# EAGLE design CHECon (EAGLE 6.5.0)
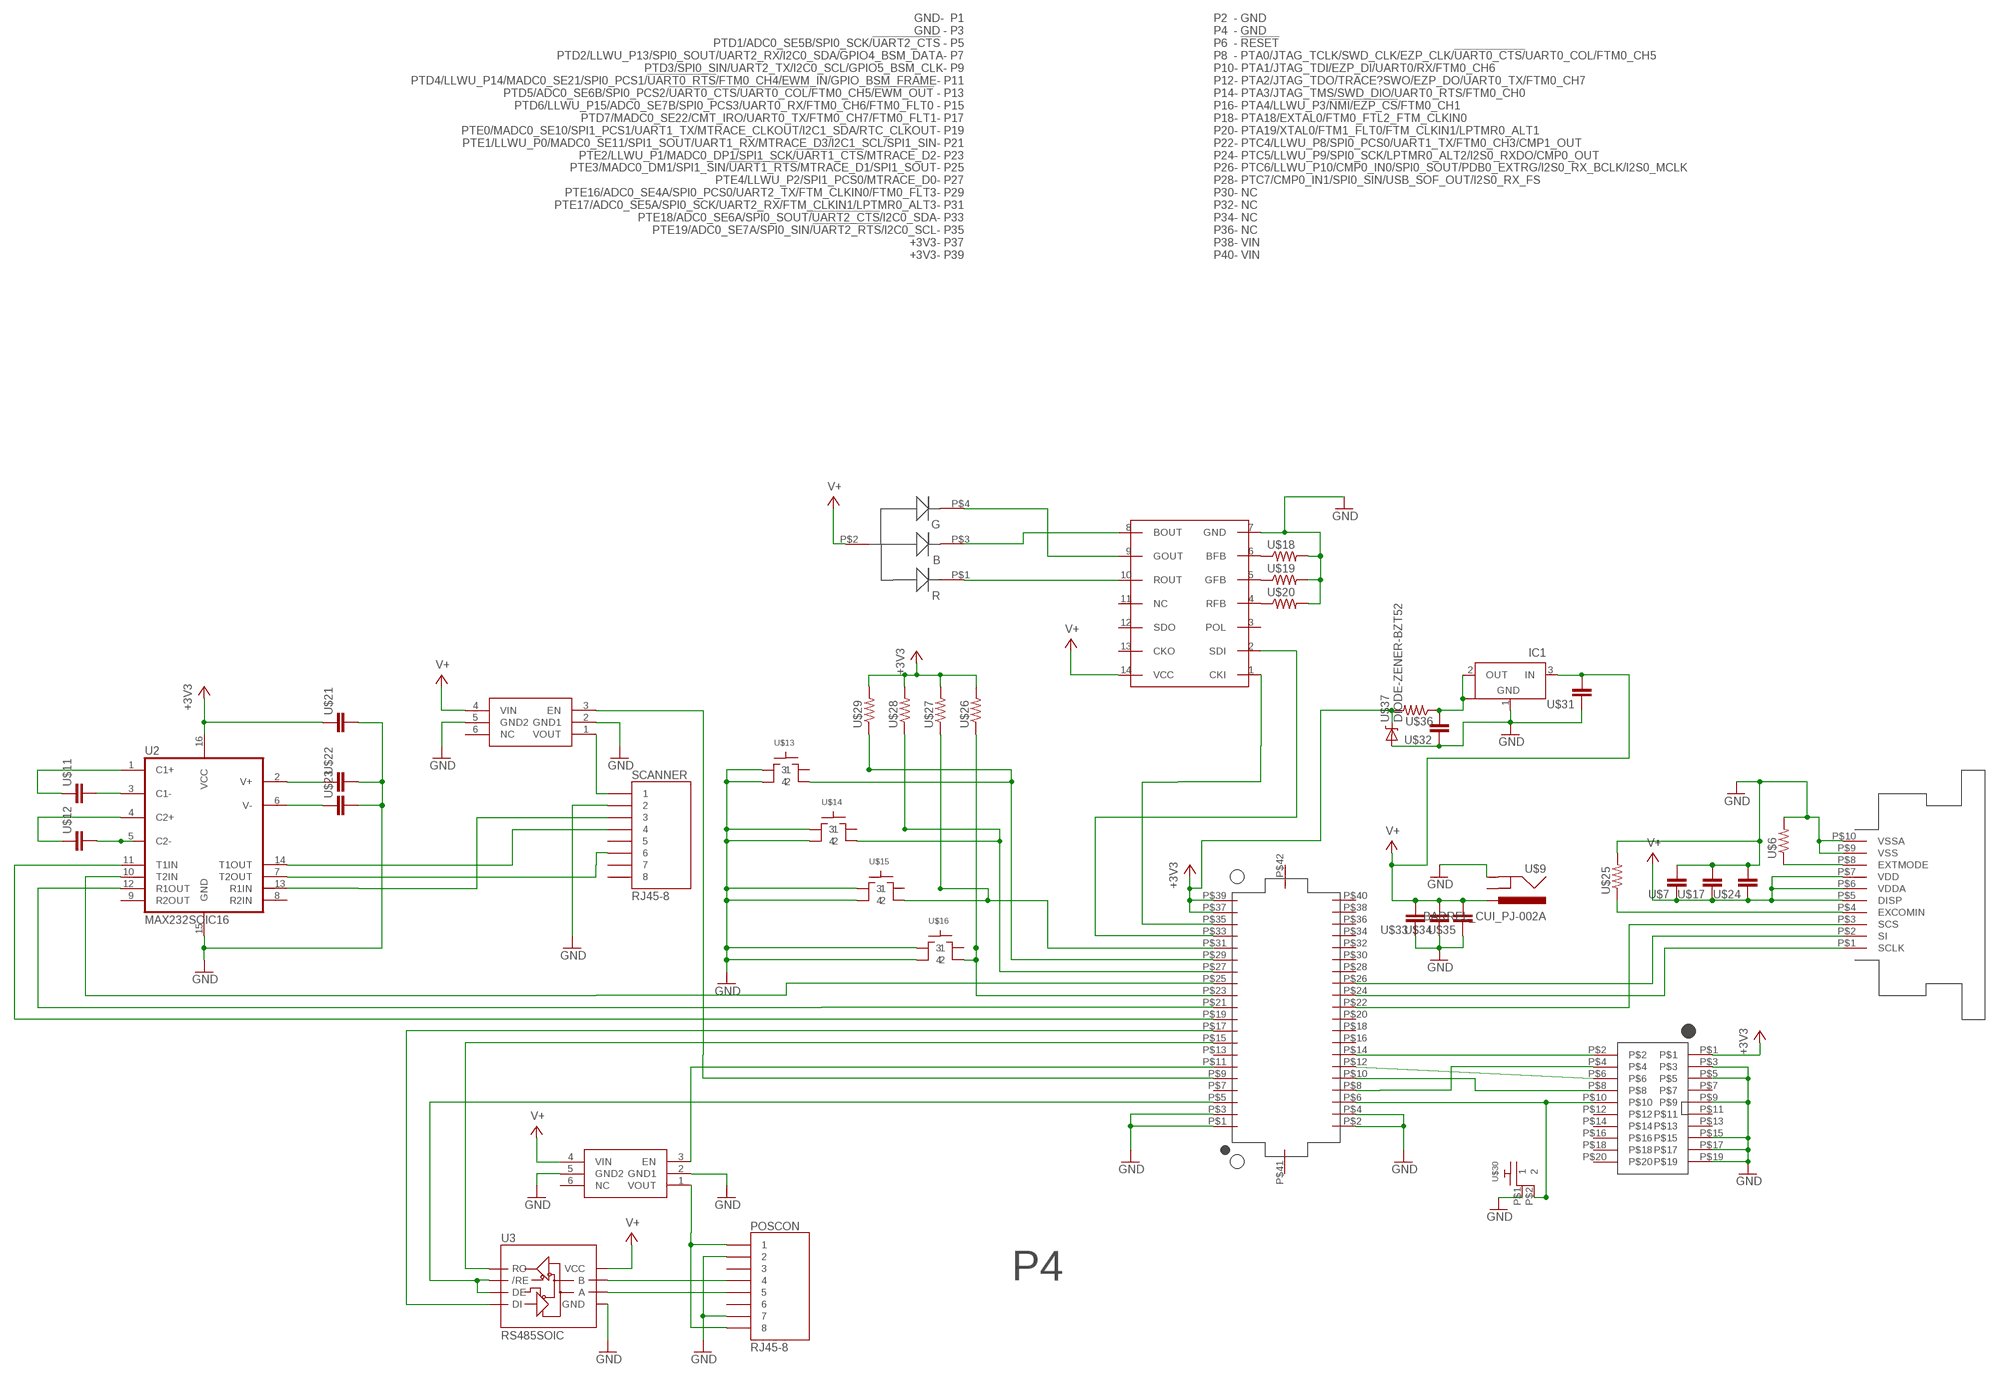
[diagram p0: schematic, sheet 1]

## Parts
IC1  NCP1117ST33T3G_1  [SOT223]
POSCON  RJ45-8  [MOLEX-0955016649]
SCANNER  RJ45-8  [MOLEX-0955016649]
U2  MAX232SOIC16  [SO016]
U3  RS485SOIC  [SO08]
U$1  RGLBED  [RGBLED]
U$2  52745-1097  [52745-1097]
U$3  2X10JTAG  [2X10JTAG]
U$4  MIC94061C6  [SC70-6L]
U$5  MIC94061C6  [SC70-6L]
U$6  RF-R0805  [RF-C0805]
U$7  RF-C0805  [C0805]
U$8  WS2801  [SO14]
U$9  BARREL_CUI_PJ-002A  [BARREL_CUI_PJ-002A]
U$10  DF12_F  [DF12_F]
U$11  RF-C0805  [C0805]
U$12  RF-C0805  [C0805]
U$13  SWITCH-TACTILE  [ESWITCH-TL3301PF]
U$14  SWITCH-TACTILE  [ESWITCH-TL3301PF]
U$15  SWITCH-TACTILE  [ESWITCH-TL3301PF]
U$16  SWITCH-TACTILE  [ESWITCH-TL3301PF]
U$17  RF-C0805  [C0805]
U$18  RF-R0805  [RF-C0805]
U$19  RF-R0805  [RF-C0805]
U$20  RF-R0805  [RF-C0805]
U$21  RF-C0805  [C0805]
U$22  RF-C0805  [C0805]
U$23  RF-C0805  [C0805]
U$24  RF-C0805  [C0805]
U$25  RF-R0805  [RF-C0805]
U$26  RF-R0805  [RF-C0805]
U$27  RF-R0805  [RF-C0805]
U$28  RF-R0805  [RF-C0805]
U$29  RF-R0805  [RF-C0805]
U$30  RA_BUTTON  [RA_BUTTON]
U$31  RF-C0805  [C0805]
U$32  RF-C0805  [C0805]
U$33  RF-C0805  [C0805]
U$34  RF-C0805  [C0805]
U$35  RF-C0805  [C0805]
U$36  RF-R0805  [RF-C0805]
U$37  DIODE-ZENER-BZT52  [SOD-323]

## Nets
+3V3: U2.16(VCC) U$3.P$1 U$10.P$37(+3V3) U$10.P$39(+3V3) U$21.1 U$26.2 U$27.2 U$28.2 U$29.2 U$36.2 U$37.1(C)
C1: U2.1(C1+) U$11.1
C2: U2.4(C2+) U$12.1
GND [GND]: IC1.1(GND) POSCON.P$2 POSCON.P$7 SCANNER.P$2 U2.15(GND) U3.5(GND) U$2.P$9(VSS) U$2.P$10(VSSA) U$3.P$3 U$3.P$5 U$3.P$9 U$3.P$15 U$3.P$17 U$3.P$19 U$4.2(GND1) U$4.5(GND2) U$5.2(GND1) U$5.5(GND2) U$6.2 U$7.2 U$8.7(GND) U$9.P$2(GND) U$10.P$1(GND) U$10.P$2(GND) U$10.P$3(GND) U$10.P$4(GND) U$13.1 U$13.2 U$14.1 U$14.2 U$15.1 U$15.2 U$16.1 U$16.2 U$17.2 U$18.2 U$19.2 U$20.2 U$21.2 U$22.2 U$23.2 U$24.2 U$25.2 U$30.P$1 U$31.1 U$32.1 U$33.1 U$34.1 U$35.1 U$37.2(A)
N$1: U$3.P$2 U$10.P$14(PTA3/JTAG_TMS/SWD_DIO/UART0_RTS/FTM0_CH0)
N$2: U$3.P$6 U$10.P$12(PTA2/JTAG_TDO/TRACE?SWO/EZP_DO/UART0_TX/FTM0_CH7)
N$3: U$3.P$8 U$10.P$10(PTA1/JTAG_TDI/EZP_DI/UART0/RX/FTM0_CH6)
N$4: U$3.P$4 U$10.P$8(PTA0/JTAG_TCLK/SWD_CLK/EZP_CLK/!UART0_CTS/!UART0_COL/FTM0_CH5)
N$5: U$1.P$4(GREEN) U$8.9(GOUT)
N$6: U$3.P$10 U$10.P$6(!RESET) U$30.P$2
N$7: SCANNER.P$6 U2.7(T2OUT)
N$8: U$1.P$3(BLUE) U$8.8(BOUT)
N$9: U$1.P$1(RED) U$8.10(ROUT)
N$10 [GND]: U2.12(R1OUT) U$10.P$21(PTE1/LLWU_P0/MADC0_SE11/SPI1_SOUT/UART1_RX/MTRACE_D3/I2C1_SCL/SPI1_SIN)
N$11: U$8.1(CKI) U$10.P$35(PTE19/ADC0_SE7A/SPI0_SIN/!UART2_RTS!/I2C0_SCL)
N$12 [GND]: SCANNER.P$4 U2.14(T1OUT)
N$13: U$8.6(BFB) U$18.1
N$14: U$8.5(GFB) U$19.1
N$15: U$8.4(RFB) U$20.1
N$16: U$8.2(SDI) U$10.P$33(PTE18/ADC0_SE6A/SPI0_SOUT/!UART2_CTS!/I2C0_SDA)
N$17 [GND]: U3.1(RO) U$10.P$15(PTD6/LLWU_P15/ADC0_SE7B/SPI0_PCS3/UART0_RX/FTM0_CH6/FTM0_FLT0)
N$18: U2.3(C1-) U$11.2
N$19: POSCON.P$4 U3.7(B)
N$20: POSCON.P$5 U3.6(A)
N$21: U2.5(C2-) U$12.2
N$22: U2.6(V-) U$23.1
N$23: U2.2(V+) U$22.1
N$24: POSCON.P$1 POSCON.P$8 U$5.1(VOUT)
N$25 [GND]: SCANNER.P$1 U$4.1(VOUT)
N$26 [GND]: U2.11(T1IN) U$10.P$19(PTE0/MADC0_SE10/SPI1_PCS1/UART1_TX/MTRACE_CLKOUT/I2C1_SDA/RTC_CLKOUT)
N$27 [GND]: U3.4(DI) U$10.P$17(PTD7/MADC0_SE22/CMT_IRO/UART0_TX/FTM0_CH7/FTM0_FLT1)
N$28 [GND]: U3.2(/RE) U3.3(DE) U$10.P$5(PTD1/ADC0_SE5B/SPI0_SCK/!UART2_CTS)
N$29 [GND]: U$2.P$2(SI) U$10.P$26(PTC6/LLWU_P10/CMP0_IN0/SPI0_SOUT/PDB0_EXTRG/I2S0_RX_BCLK/I2S0_MCLK)
N$30 [GND]: U$2.P$1(SCLK) U$10.P$24(PTC5/LLWU_P8/SPI0_PCS0/UART1_TX/FTM0_CH3/CMP1_OUT)
N$31 [GND]: U$2.P$3(SCS) U$10.P$22(PTC4/LLWU_P8/SPI0_PCS0/UART1_TX/FTM0_CH3/CMP1_OUT)
N$32 [GND]: U$2.P$8(EXTMODE) U$6.1
N$33 [GND]: U$2.P$4(EXCOMIN) U$25.1
N$34: U$10.P$23(PTE2/LLWU_P1/MADC0_DP1/SPI1_SCK/!UART1_CTS!/MTRACE_D2) U$16.4 U$26.1
N$35: U$10.P$31(PTE17/ADC0_SE5A/SPI0_SCK/UART2_RX/FTM_CLKIN1/LPTMR0_ALT3) U$15.4 U$27.1
N$36: U$10.P$27(PTE4/LLWU_P2/SPI1_PCS0/MTRACE_D0) U$14.4 U$28.1
N$37: U$10.P$29(PTE16/ADC0_SE4A/SPI0_PCS0/UART2_TX/FTM_CLKIN0/FTM0_FLT3) U$13.4 U$29.1
N$39: U$5.3(EN) U$10.P$11(PTD4/LLWU_P14/MADC0_SE21/SPI0_PCS1/!UART0_RTS!/FTM0_CH4/EWM_IN/GPIO_BSM_FRAME)
N$40: U$4.3(EN) U$10.P$9(PTD3/SPI0_SIN/UART2_TX/I2C0_SCL/GPIO5_BSM_CLK)
N$41: U2.10(T2IN) U$10.P$25(PTE3/MADC0_DM1/SPI1_SIN/!UART1_RTS!/MTRACE_D1/SPI1_SOUT)
OUT1: IC1.2(OUT) IC1.4(OUT1) U$32.2 U$36.1
R1IN: SCANNER.P$3 U2.13(R1IN)
V+: IC1.3(IN) U3.8(VCC) U$1.P$2(ANODE) U$2.P$5(DISP) U$2.P$6(VDDA) U$2.P$7(VDD) U$4.4(VIN) U$5.4(VIN) U$7.1 U$8.14(VCC) U$9.P$1(PWR) U$17.1 U$24.1 U$31.2 U$33.2 U$34.2 U$35.2
Unconnected: POSCON.P$3 POSCON.P$6 SCANNER.P$5 SCANNER.P$7 SCANNER.P$8 U2.8(R2IN) U2.9(R2OUT) U$3.P$7 U$3.P$11 U$3.P$12 U$3.P$13 U$3.P$14 U$3.P$16 U$3.P$18 U$3.P$20 U$4.6(NC) U$5.6(NC) U$8.3(POL) U$8.11(NC) U$8.12(SDO) U$8.13(CKO) U$9.P$3(GNDBREAK) U$10.P$7(PTD2/LLWU_P13/SPI0_SOUT/UART2_RX/I2C0_SDA/GPIO4_BSM_DATA) U$10.P$13(PTD5/ADC0_SE6B/SPI0_PCS2/!UART0_CTS!/!UART0_COL!/FTM0_CH5/!EWM_OUT) U$10.P$16(PTA4/LLWU_P3/!NMI!/!EZP_CS!/FTM0_CH1) U$10.P$18(PTA18/EXTAL0/FTM0_FTL2_FTM_CLKIN0) U$10.P$20(PTA19/XTAL0/FTM1_FLT0/FTM_CLKIN1/LPTMR0_ALT1) U$10.P$28(PTC7/CMP0_IN1/SPI0_SIN/USB_SOF_OUT/I2S0_RX_FS) U$10.P$30(NC) U$10.P$32(NC) U$10.P$34(NC) U$10.P$36(NC) U$10.P$38(VIN) U$10.P$40(VIN) U$10.P$41 U$10.P$42 U$13.3 U$14.3 U$15.3 U$16.3

## Notes on the sheet
- P4

## Library data of the parts
IC1 = KW2:NCP1117ST33T3G_1: VOLTAGE REGULATOR
POSCON SCANNER = GW-devices:RJ45-8: RJ45 Jack MFG part number 54602-908lf; MFGP: 0955016889
U2 = SparkFun:MAX232: RS232 Transceiver Very common IC. This is generically called 'MAX232', but works with the 3V equivalent MAX3232 generic ICs. Field tested and mother approved. Spark Fun Electronics SKU : COM-00316 (DIP) and COM-00589 (SMD); MFGN: TI; MFGP: MAX232DR; PRICE: 0.86
U3 = SparkFun:RS485; MFGN: TI; MFGP: SN65HVD1781DR; PRICE: 4.29
U$1 = KW2:RGLBED; MFGP: CLV1A-FKB-CK1N1G1BB7R4S3
U$2 = KW2:52745-1097; MFGP: 52745-1097
U$3 = KW2:2X10JTAG; MFGP: 3220-20-0100-00
U$4 U$5 = GW-devices:MIC94061; MFGN: Micrel; MFGP: MIC94061YC6 TR; PRICE: 1.50
U$6 U$25-U$29 U$36 = GW-devices:RF-R: RF resistor pads for FSL reference design; MFGP: CRCW080510K0FKEB
U$7 = GW-devices:RF-C: RF capacitor pads for FSL reference design; MFGP: C0805C106M4PACTU
U$8 = GW-devices:WS2801; MFGP: WS2801
U$9 = KW2:BARREL_CUI_PJ-002A; MFGP: PJ-002A
U$10 = KW2:DF12_F; MFGP: DF12(3.0)-40DP-0.5V(86)
U$11 U$12 U$17 U$21-U$23 = GW-devices:RF-C: RF capacitor pads for FSL reference design; MFGP: 0805YD105KAT2A
U$13-U$16 = GW-devices:SWITCH-TACTILE; MFGP: TL3301DF260QG
U$18-U$20 = GW-devices:RF-R: RF resistor pads for FSL reference design; MFGP: CRCW080524R0JNEA
U$24 U$31-U$35 = GW-devices:RF-C: RF capacitor pads for FSL reference design; MFGP: 0805YD104KAT2A
U$30 = KW2:RA_BUTTON; MFGP: 1-1825027-1
U$37 = SparkFun:DIODE-ZENER: Zener Diode Production Part - 8199 3.4V Zener Voltage

## Board
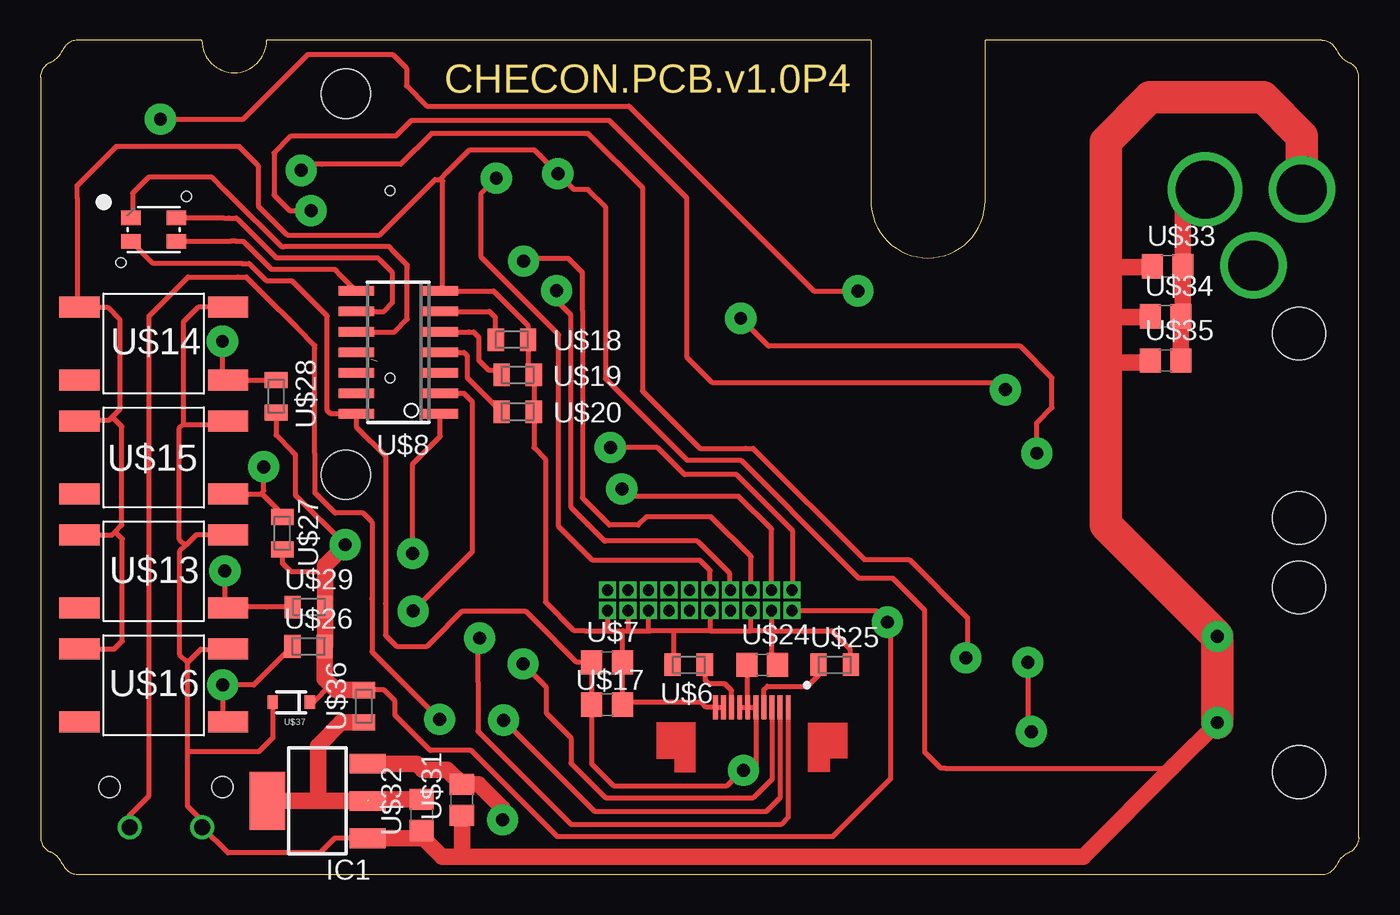
[diagram p1: board, top side]
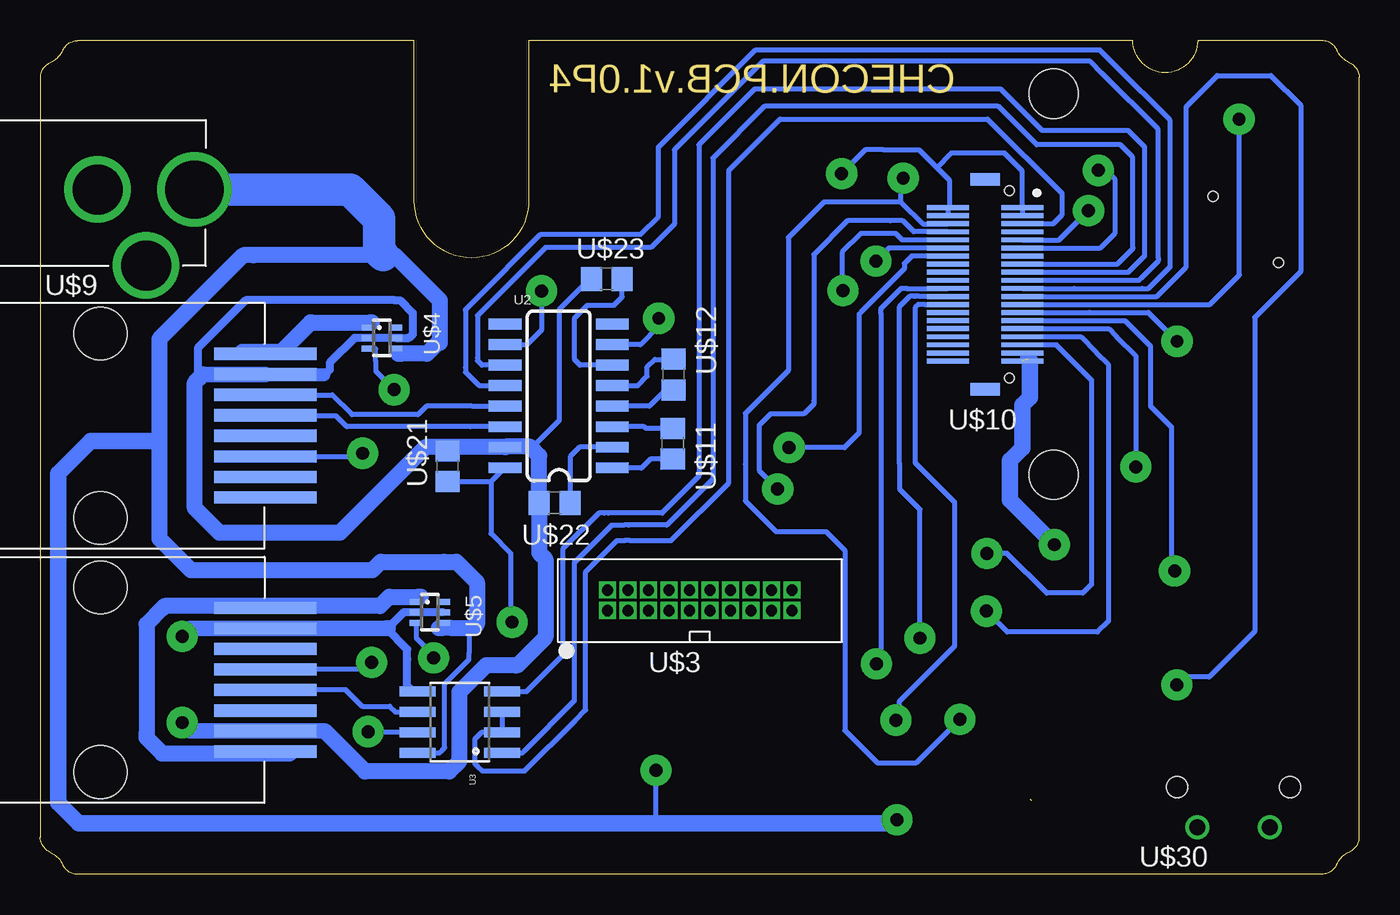
[diagram p2: board, bottom side, seen from below]

Size 81.68 x 51.66 mm. Coordinates in mm from the lower left corner, seen from the top.
Outline: 81.66,2.29 81.66,49.38 arc66 81.07,50.28
Outline: 2.31,0 79.37,0 arc67 80.29,0.61
Outline: 0.02,49.38 0.02,2.29 arc66 0.61,1.38
Outline: 79.37,51.66 58.52,51.66 58.52,41.73 arc-180 51.43,41.73 51.43,51.66 14.02,51.66 arc-180 10,51.66 2.31,51.66 arc67 1.39,51.06
Outline: 79.37,51.66 arc-67 80.29,51.05 arc43 81.07,50.28
Outline: 81.68,2.29 arc-66 81.07,1.37 arc43 80.3,0.6
Outline: 2.31,0.01 arc-67 1.39,0.61 arc43 0.61,1.39
Outline: 0,49.38 arc-66 0.61,50.29 arc43 1.38,51.06
Copper layers (1*16): Top 0.035mm / dielectric 1.5mm / Bottom 0.035mm
Design rules "default *": minimum track width 10mil, minimum drill 0.1mm, track to track 0.4mm, track to pad 0.4mm, pad to pad 0.4mm, via to via 0.4mm, smd to smd 0.4mm, copper to edge 0.1mm, drill to drill 0.1mm, minimum pad ring 0.1mm, minimum via ring 8mil, stop-mask expansion 4mil, vias tented up to drill 0mil, thermal gap 10mil

### Footprints (pad centres in the part's own frame; a part is rotated, then mirrored left to right if it is on the bottom)
SOT223 = smd 1.219 x 2.235: 1 -2.311,-3.099; 2 0,-3.099; 3 2.311,-3.099 | smd 3.6 x 2.2: 4 0,3.099
MOLEX-0955016649 = smd 0.76 x 6.35: P$1 -4.45,10.225; P$2 -3.18,10.225; P$3 -1.91,10.225; P$4 -0.64,10.225; P$5 0.63,10.225; P$6 1.905,10.225; P$7 3.175,10.225; P$8 4.445,10.225 | hole 3.25: -5.715,0; 5.715,0
SO016 = smd 0.66 x 2.032: 1 -4.445,-3.315; 2 -3.175,-3.315; 3 -1.905,-3.315; 4 -0.635,-3.315; 5 0.635,-3.315; 6 1.905,-3.315; 7 3.175,-3.315; 8 4.445,-3.315; 9 4.445,3.315; 10 3.175,3.315; 11 1.905,3.315; 12 0.635,3.315; 13 -0.635,3.315; 14 -1.905,3.315; 15 -3.175,3.315; 16 -4.445,3.315
SO08 = smd 0.61 x 2.21: 1 -1.905,-2.616; 2 -0.635,-2.616; 3 0.635,-2.616; 4 1.905,-2.616; 5 1.905,2.616; 6 0.635,2.616; 7 -0.635,2.616; 8 -1.905,2.616
RGBLED = smd 1.2 x 0.9: P$1 1.4,-0.725; P$2 1.4,0.725; P$3 -1.4,0.725; P$4 -1.4,-0.725 | hole 0.61: 2.019,2.045; -2.019,-2.045
52745-1097 = smd 0.3 x 1.5: P$1 2.25,0.95; P$2 1.75,0.95; P$3 1.25,0.95; P$4 0.75,0.95; P$5 0.25,0.95; P$6 -0.25,0.95; P$7 -0.75,0.95; P$8 -1.25,0.95; P$9 -1.75,0.95; P$10 -2.25,0.95
2X10JTAG = drill 0.7 pad 1 square: P$1 -6.35,-1.27; P$2 -6.35,0; P$3 -5.08,-1.27; P$4 -5.08,0; P$5 -3.81,-1.27; P$6 -3.81,0; P$7 -2.54,-1.27; P$8 -2.54,0; P$9 -1.27,-1.27; P$10 -1.27,0; P$11 0,-1.27; P$12 0,0; P$13 1.27,-1.27; P$14 1.27,0; P$15 2.54,-1.27; P$16 2.54,0; P$17 3.81,-1.27; P$18 3.81,0; P$19 5.08,-1.27; P$20 5.08,0
SC70-6L = smd 0.35 x 0.8: 1 -0.65,-0.85; 2 0,-0.85; 3 0.65,-0.85; 4 0.65,0.85; 5 0,0.85; 6 -0.65,0.85
RF-C0805 = smd 1 x 1.4: 1 -1,0; 2 1,0
C0805 = smd 1.3 x 1.5: 1 -0.95,0; 2 0.95,0
SO14 = smd 0.6 x 2.2: 1 -3.81,-2.6; 2 -2.54,-2.6; 3 -1.27,-2.6; 4 0,-2.6; 5 1.27,-2.6; 6 2.54,-2.6; 7 3.81,-2.6; 8 3.81,2.6; 9 2.54,2.6; 10 1.27,2.6; 11 0,2.6; 12 -1.27,2.6; 13 -2.54,2.6; 14 -3.81,2.6
BARREL_CUI_PJ-002A = drill 3.6: P$1 0,0 | drill 3.1: P$2 6,0; P$3 3,4.7
DF12_F = smd 0.3 x 2.6: P$1 -4.75,2.3; P$2 -4.75,-2.3; P$3 -4.25,2.3; P$4 -4.25,-2.3; P$5 -3.75,2.3; P$6 -3.75,-2.3; P$7 -3.25,2.3; P$8 -3.25,-2.3; P$9 -2.75,2.3; P$10 -2.75,-2.3; P$11 -2.25,2.3; P$12 -2.25,-2.3; P$13 -1.75,2.3; P$14 -1.75,-2.3; P$15 -1.25,2.3; P$16 -1.25,-2.3; P$17 -0.75,2.3; P$18 -0.75,-2.3; P$19 -0.25,2.3; P$20 -0.25,-2.3; P$21 0.25,2.3; P$22 0.25,-2.3; P$23 0.75,2.3; P$24 0.75,-2.3; P$25 1.25,2.3; P$26 1.25,-2.3; P$27 1.75,2.3; P$28 1.75,-2.3; P$29 2.25,2.3; P$30 2.25,-2.3; P$31 2.75,2.3; P$32 2.75,-2.3; P$33 3.25,2.3; P$34 3.25,-2.3; P$35 3.75,2.3; P$36 3.75,-2.3; P$37 4.25,2.3; P$38 4.25,-2.3; P$39 4.75,2.3; P$40 4.75,-2.3 | smd 0.8 x 1.8: P$41 -6.5,0; P$42 6.5,0 | hole 0.6: -5.8,1.5; 5.8,1.5 | hole 3.048: -11.8,4.24; 11.8,4.24
ESWITCH-TL3301PF = smd 2.5 x 1.3: 1 -4.61,2.25; 2 4.61,2.25; 3 -4.61,-2.25; 4 4.61,-2.25
RA_BUTTON = drill 0.99: P$1 -2.25,0; P$2 2.25,0 | hole 1.3: -3.501,2.49; 3.501,2.49
SOD-323 = smd 0.63 x 0.83: 1 -1.15,0; 2 1.15,0

### Placement (x,y rotation side)
IC1  17.17,4.55 90 top
POSCON  77.96,12.05 270 bottom
SCANNER  77.96,27.79 270 bottom
U2  49.58,29.64 90 bottom
U3  55.7,9.42 90 bottom
U$1  7.02,39.94 180 top
U$2  44.07,9.4 0 top
U$3  40.2,17.61 0 bottom
U$4  60.52,33.22 270 bottom
U$5  57.55,16.23 270 bottom
U$6  40.15,12.98 180 top
U$7  35.1,13.13 0 top
U$8  22.17,32.33 90 top
U$9  72.13,42.42 180 bottom
U$10  23.16,36.55 270 bottom
U$11  42.52,26.67 90 bottom
U$12  42.46,30.96 90 bottom
U$13  7.02,18.77 0 top
U$14  7.02,32.88 0 top
U$15  7.02,25.82 0 top
U$16  7.02,11.71 0 top
U$17  35.1,10.52 0 top
U$18  29.21,33.12 0 top
U$19  29.56,30.94 0 top
U$20  29.56,28.65 0 top
U$21  56.46,25.27 90 bottom
U$22  49.83,23.01 180 bottom
U$23  46.61,36.88 180 bottom
U$24  44.7,12.98 0 top
U$25  49.2,12.98 0 top
U$26  16.61,14.12 0 top
U$27  14.98,21.13 270 top
U$28  14.6,29.62 270 top
U$29  16.63,16.56 0 top
U$30  7.77,2.92 0 bottom
U$31  26.11,4.62 90 top
U$32  23.62,3.68 90 top
U$33  69.82,37.67 0 top
U$34  69.69,34.57 0 top
U$35  69.69,31.83 0 top
U$36  20.04,10.41 90 top
U$37  15.54,10.67 180 top

### Tracks (layer width: path | path; a pad name or v marks a point on that pad's centre or on a via)
+3V3  (via drill 0.8 pad 1.93)  (1 unrouted)
  Top 0.305: U$3.P$1 49.7,16.34 51.76,16.34 v52.47,15.62 52.68,15.42 52.68,5.94 49.07,2.34 32.03,2.34 26.69,7.67 24.15,7.67 23.39,8.43 21.97,9.85 21.97,10.74 21.3,11.41 U$36.2 | U$27.2 14.98,19.28 15.49,18.77 17.63,18.77 | U$28.2 14.6,27.2 15.57,26.24 15.8,26.01 15.8,23.49 v18.87,20.42 | U$37.1 16.91,10.67 17.98,11.73
  Top 1.016: v18.87,20.42 18.87,20.38 17.63,19.14 17.63,18.77 U$29.2 17.63,14.15 U$26.2 17.61,12.1 17.98,11.73 18.29,11.41 U$36.2
  Bottom 0.305: 21.61,25.65 21.64,25.63 | U$10.P$37 U$10.P$39 | U$21.1 53.77,24.32 | 53.77,24.32 U2.16 | 53.77,24.32 53.77,21.1 52.55,19.89 52.55,15.7 v52.47,15.62
  Bottom 1.016: 21.61,25.65 20.86,26.4 20.86,29.07 20.39,29.54 20.39,31.83 20.49,31.93 | v18.87,20.42 20.52,22.07 21.64,23.19 21.64,25.63
C1
  Bottom 0.305: U$11.1 43.9,25.72 44.45,25.17 46.24,25.17 U2.1
C2
  Bottom 0.305: U$12.1 42.96,30.01 43.96,29.01 U2.4
GND  (via drill 0.8 pad 1.93)
  Top 0.305: U$3.P$9 41.47,15.09 | 41.47,15.09 39.21,15.09 | 39.21,15.09 37.79,15.09 | 37.79,15.09 37.66,15.09 U$3.P$15 | U$3.P$17 36.39,15.09 36.45,15.09 | 36.45,15.09 37.79,15.09 | U$3.P$19 35.12,15.09 35.25,15.09 | 35.25,15.09 36.06,15.09 | 36.06,15.09 36.45,15.09 | 41.47,15.09 44.01,15.09 | 44.01,15.09 U$3.P$5 | 35.25,15.09 33.7,15.09 33.07,15.09 31.29,16.87 31.29,25.7 30.56,26.43 U$20.2 U$19.2 30.21,31.29 U$18.2 30.2,33.13 30.2,34.01 29.59,34.62 28.06,36.14 24.91,36.14 | U$16.2 11.72,14.05 11.73,14.05 11.3,14.05 11.17,13.92 11.15,13.94 9.93,13.94 9.11,13.13 | U$15.2 11.63,27.89 11.58,27.84 8.99,27.84 | 45.67,13.03 45.65,13.01 U$24.2 45.28,13.34 45.28,15.09 | U$8.7 24.91,36.14 | 24.91,36.14 24.91,42.95 24.82,43.04 | 24.82,43.04 24.79,43.08 25.23,43.52 26.59,44.88 30.6,44.88 30.6,44.86 31.96,43.5 32.15,43.31 | U$2.P$9 U$2.P$10 41.24,10.35 40.94,10.64 36.18,10.64 U$17.2 U$7.2 36.05,15.07 36.06,15.09 | U$3.P$3 45.28,15.09 | 45.28,15.09 44.01,15.09 | 45.28,15.09 49.02,15.09 50.14,13.97 50.14,13.04 U$25.2 | 39.21,15.09 39.21,13.04 U$6.2 | 32.15,43.31 33.04,42.42 33.93,42.42 35,41.35 35,30.71 38.38,27.33 40.05,25.65 43.38,25.65 49.63,19.41 50.69,18.34 52.8,18.34 54.78,16.36 54.78,7.57 55.77,6.58 56.05,6.58 70.05,6.58 70.07,6.58 70.15,6.65 | 32.15,43.31 v32.05,43.41 | IC1.1 18.23,2.23 17.32,1.32 11.62,1.32 U$30.P$1 10.02,3.31 9.11,4.22 9.11,7.65 | 4.45,28.33 4.92,28.8 4.92,34.37 4.16,35.13 U$14.1 2.28,35.26 2.28,41.91 2.28,42.67 4.7,45.08 12.32,45.08 13.46,43.94 13.51,43.89 13.51,41.38 14.02,40.87 15.29,39.6 21,39.6 24.44,43.04 24.82,43.04 | 4.45,28.33 4.24,28.12 2.46,28.12 U$15.1
  Top 0.305: U$13.1 4.43,21.02 4.63,21.22 | 4.63,21.22 5.05,21.64 5.05,27.74 4.45,28.33 | U$16.1 4.58,13.96 5.08,14.45 5.08,20.78 4.63,21.22 | 9.11,7.65 9.11,13.13 | U$13.2 9.64,21.02 8.99,20.37 | 8.99,20.37 8.61,19.99 8.61,13.64 9.11,13.13 | 8.99,27.84 8.81,27.84 8.58,27.61 8.58,20.78 8.99,20.37 | U$14.2 9.78,35.13 8.86,34.21 8.86,27.97 8.99,27.84 | U$33.1 68.82,37.62 | U$34.1 68.69,34.52 | U$35.1 68.62,31.7 | 9.11,7.65 9.17,7.59 13.53,7.59 14.39,8.45 U$37.2
  Top 1.016: 70.15,6.65 70.28,6.78 | 70.28,6.78 v72.89,9.4 | 70.28,6.78 64.59,1.09 26.01,1.09 | 26.01,1.09 24.89,1.09 23.75,2.23 23.62,2.23 | 23.62,2.23 IC1.1 | U$32.1 23.62,2.23 | U$31.1 26.11,1.19 26.01,1.09 | 68.82,37.62 65.99,37.62 | 68.69,34.52 65.99,34.52 | 68.62,31.7 65.99,31.7
  Top 2: U$9.P$2 78.13,45.74 75.74,48.13 68.73,48.13 65.99,45.39 65.99,40.87 65.99,37.62 65.99,34.52 65.99,31.7 65.99,22.43 65.99,21.64 v72.89,14.73 v72.89,9.4
  Bottom 0.305: U$10.P$3 U$10.P$1 20.86,43.06 20.86,43.55 20.86,43.57 21.97,44.68 25.27,44.68 26.16,43.79 | U$10.P$2 25.47,41.31 U$10.P$2 | U$5.5 56.77,16.23 | POSCON.P$2 | 51.32,26.45 51.36,26.49 | 52.87,26.49 U2.15 | 56.22,26.47 U$21.2 | 26.16,43.79 27.25,44.88 29.46,44.88 30.58,44.88 v32.05,43.41 | 26.16,43.79 25.38,43.01 25.38,41.38 U$10.P$2 | U$23.2 47.67,36.88 49.55,35 49.55,28.12 51.27,26.4 | U$10.P$2 U$10.P$4
  Bottom 0.406: 67.7,30.94 SCANNER.P$2
  Bottom 0.5: 56.77,16.23 U$5.2 59.18,16.23 60.17,15.24 | 60.25,15.24 58.95,13.94 58.95,13.33 58.95,11.68 58.59,11.33 U3.5 | U$4.5 59.31,33.22 | 59.31,33.22 U$4.2 61.82,33.22 62.23,33.22 63.75,31.7 63.75,31.27 64.11,30.91 64.16,30.91 64.13,30.94 64.11,30.94 | 59.31,33.22 58.95,33.22 58.85,33.22 58.62,33.45 58.62,34.77 59.41,35.56 59.74,35.56 68.96,35.56 71.93,32.59 71.93,30.84 71.83,30.73
  Bottom 0.813: 64.11,30.94 64.13,30.94 67.7,30.94 | 72.39,15.23 v72.89,14.73
  Bottom 0.95: 60.25,15.24 POSCON.P$2 | POSCON.P$2 72.39,15.23 | 71.6,30.96 67.74,30.96 SCANNER.P$2 | v72.89,9.4 72.79,9.3 72.37,8.88 POSCON.P$7 64.09,8.88 64.07,8.88 64.01,8.82
  Bottom 1: 60.17,15.24 60.25,15.24 | 51.32,26.45 51.27,26.4 50.78,25.92 U$22.2 50.78,19.92 50.39,19.53 50.39,14.68 50.96,14.11 | 51.36,26.49 52.87,26.49 | U2.15 56.22,26.47 57.83,26.47 60.83,23.47 63.14,21.16 70.58,21.16 72.11,22.68 72.11,30.45 71.83,30.73 71.6,30.96 | 64.01,8.82 61.57,6.38 56.36,6.38 55.72,7.01 55.72,8.1 55.72,11.3 54.07,12.95 52.32,12.95 52.12,12.95 50.96,14.11 | 50.96,14.11 50.69,14.38
N$1  (via drill 0.8 pad 1.93)
  Top 0.305: U$3.P$2 46.58,17.63 46.58,21.31 43.13,24.76 39.9,24.76 38.22,26.44 v35.3,26.44
  Bottom 0.305: U$10.P$14 27.61,38.3 27.71,38.3 28.16,37.85 28.16,37.52 30.88,34.8 30.96,34.72 30.96,34.42 30.96,27.36 31.87,26.44 v35.3,26.44
N$2  (via drill 0.8 pad 1.93)
  Top 0.305: U$3.P$6 44.01,19.68 41.55,22.15 37.54,22.15 37.03,21.64 35.25,21.64 33.58,23.32 33.58,34.95 33.58,37.29 32.71,38.15 29.94,38.15 29.94,38.02 v29.92,38
  Bottom 0.305: 25.47,38.81 U$10.P$12 28.99,38.8 29.12,38.8 v29.92,38
N$3  (via drill 0.8 pad 1.93)
  Top 0.305: U$3.P$8 42.67,17.68 42.67,18.67 40.69,20.65 35,20.65 34.95,20.65 32.84,22.76 32.84,34.67 31.97,35.53 v31.97,36.17
  Bottom 0.305: U$10.P$10 28.3,39.3 28.7,39.7 30.86,39.7 32.03,38.53 32.03,36.7 | 32.03,36.7 32.03,36.42 | v31.97,36.17 31.97,36.22 31.97,36.25 32.03,36.3 32.03,36.7
N$4  (via drill 0.8 pad 1.93)
  Top 0.305: U$3.P$4 45.28,21.39 43.25,23.42 37.54,23.42 36.47,23.42 v36.01,23.88
  Bottom 0.305: U$10.P$8 27.58,39.8 28.27,40.49 29.05,40.49 31.7,40.49 33.78,38.4 33.78,29.34 33.78,29.13 34.39,28.52 35.81,28.52 36.45,28.52 37.16,27.81 37.16,25.02 v36.01,23.88
N$5
  Top 0.305: U$8.9 21.28,34.87 21.81,35.41 21.81,37.26 21.13,37.95 21.03,38.05 20.9,38.18 15.29,38.18 14.63,38.18 12.24,40.56 12.14,40.67 11.68,40.67 11.35,40.67 8.63,40.67 8.56,40.59 8.5,40.59 U$1.P$4
N$6  (via drill 0.8 pad 1.93)
  Top 0.305: U$3.P$10 41.47,18.82 40.84,19.46 34.41,19.46 34.21,19.46 32.1,21.56 32.1,33.43 31.54,33.98 27.3,38.23 27.3,38.25 27.3,42.19 v28.24,43.13 | U$30.P$2 5.52,3.67 6.73,4.88 6.73,34.59 9.14,37.01 12.24,37.01 12.75,37.01 13.81,35.94 15.92,33.83 16.99,32.77 16.99,32.59 16.99,26.06 16.99,23.65 18.26,22.38 19.99,22.38 20.54,21.82 20.54,17.12 20.54,17.04 20.54,13.79 v24.74,9.6 24.23,10.11
  Bottom 0.305: 28.37,41.66 27,40.28 25.48,40.28 U$10.P$6 | 28.37,41.66 28.37,43 v28.24,43.13 | 28.37,41.66 29.33,41.66 33.14,41.66 33.74,41.06 | 33.7,41.1 33.74,41.06 | 33.74,41.06 35.35,39.45 35.35,31.22 38.02,28.55 38.02,25.4 38.02,23.14 36.12,21.23 33.27,21.23 33.02,21.23 31.85,20.07 31.85,8.92 29.84,6.91 27.43,6.91 v24.74,9.6
N$7  (via drill 0.8 pad 1.93)
  Top 0.305: v61.72,26.09 61.72,27.97 62.66,28.9 62.66,30.76 60.7,32.71 45.11,32.71 v43.38,34.44
  Bottom 0.305: v43.38,34.44 43.38,33.96 44.52,32.82 U2.7 | SCANNER.P$6 61.92,25.89 v61.72,26.09
N$8
  Top 0.305: U$1.P$3 11.78,39.21 12.11,39.21 12.57,39.21 12.75,39.04 14.32,37.46 14.86,37.46 18.25,37.46 18.38,37.34 18.58,37.13 U$8.8
N$9
  Top 0.305: U$8.10 21.94,33.6 22.73,34.39 22.73,37.57 22.73,37.74 21.79,38.68 21.71,38.76 21.59,38.89 15.13,38.89 14.93,38.89 11.73,42.09 11.45,42.37 10.64,43.18 6.7,43.18 5.71,42.19 5.71,40.75 U$1.P$1
N$10
  Bottom 0.305: U$10.P$21 17.65,36.3 13.46,36.3 13.05,36.3 11.71,37.64 11.71,38.05 11.71,46.71 15.15,50.15 | 15.08,50.09 15.15,50.15 | 15.15,50.15 16.07,51.08 37.39,51.08 43.4,45.06 43.4,40.74 44.5,39.65 50.69,39.65 54.82,35.52 | U2.12 54.45,30.28 54.5,30.28 55.19,30.96 55.29,31.06 55.34,31.11 55.34,31.42 55.34,34.95 55.34,35 55.19,35.15 54.91,35.43 | 54.82,35.52 54.91,35.43 | 54.91,35.43 54.82,35.52
N$11  (via drill 0.8 pad 1.93)
  Top 0.305: 24.79,28.51 U$8.1 24.76,27.13 23.06,25.43 v23.06,19.89
  Bottom 0.305: U$10.P$35 18.74,32.79 17.17,31.22 16.58,30.63 16.58,18.03 16.58,17.96 17.12,17.42 19.35,17.42 21.81,19.89 v23.06,19.89
N$12
  Bottom 0.305: U2.14 55.04,27.74 62.71,27.74 63.37,28.4 67.59,28.4 67.61,28.37
  Bottom 0.406: 67.59,28.4 67.61,28.37 67.67,28.37 SCANNER.P$4
N$13
  Top 0.305: U$8.6 27.81,34.87 28.16,34.52 28.16,33.16 U$18.1
N$14
  Top 0.305: U$8.5 26.54,33.6 26.82,33.6 27.15,33.27 27.15,31.85 27.76,31.24 28.26,31.24 U$19.1
N$15
  Top 0.305: U$8.4 25.65,32.33 26.23,32.33 26.44,32.13 26.44,30.78 U$20.1
N$16  (via drill 0.8 pad 1.93)
  Top 0.305: 24.75,29.77 U$8.2 26.23,29.79 26.77,29.26 26.77,28.83 26.77,19.99 v23.08,16.31
  Bottom 0.305: U$10.P$33 17.24,33.3 16.28,32.33 15.54,31.6 15.54,15.65 15.57,15.65 16.2,15.01 21.79,15.01 v23.08,16.31
N$17
  Bottom 0.305: U$10.P$15 15.84,37.8 14.98,37.8 14.02,38.76 14.02,38.86 14.02,44.42 14.78,45.19 19.96,45.19 22.35,47.57 36.83,47.57 40.03,44.37 40.03,24.49 42.87,21.64 45.23,21.64 45.54,21.64 46.28,21.64 48.54,19.38 48.59,19.33 48.61,19.3 48.61,18.19 48.61,10.74 51.74,7.62 51.84,7.52 U3.1
N$18
  Bottom 0.305: U$11.2 44.18,27.62 44.29,27.74 U2.3
N$19  (via drill 0.8 pad 1.93)
  Top 0.305: v61.16,13.13 61.16,9.07 v61.39,8.84
  Bottom 0.305: 67.72,12.67 POSCON.P$4 67.7,12.73 61.57,12.73 v61.16,13.13 | v61.39,8.84 61.3,8.93 61.16,8.79 U3.7
N$20
  Bottom 0.305: POSCON.P$5 67.67,11.35 67.61,11.35 67.53,11.43 62.81,11.43 62.76,11.43 61.74,10.41 60.04,10.41 59.69,10.06 U3.6
N$21
  Bottom 0.305: U2.5 44.67,30.28 44.09,30.86 44.09,31.44 43.63,31.9 U$12.2
N$22
  Bottom 0.305: U2.6 48.26,31.55 48.59,31.88 48.59,34.47 47.8,35.25 46.15,35.25 45.64,35.76 45.64,36.87 U$23.1
N$23
  Bottom 0.305: U2.2 48.28,26.47 48.87,25.88 48.87,23.03 U$22.1
N$24
  Bottom 0.305: 67.74,16.51 POSCON.P$1 67.73,16.61 67.74,16.62 | U$5.1 58.4,17.06 58.26,17.2 | 66.24,7.49 67.62,7.49 POSCON.P$8
  Bottom 1: 58.11,17.2 58.26,17.2 60.07,17.2 60.65,16.62 67.66,16.62 67.74,16.62 73.98,16.62 74.1,16.5 75.1,15.49 75.1,8.71 75.1,8.46 74.14,7.49 66.24,7.49
N$25
  Bottom 0.305: U$4.1 61.37,34.05 61.24,34.19 | SCANNER.P$1 67.74,32.36
  Bottom 1: 61.16,34.19 61.24,34.19 64.89,34.19 64.94,34.19 65.96,33.17 66.77,32.36 67.74,32.36 69.17,32.36
N$26
  Bottom 0.305: U$10.P$19 18.11,36.8 13.84,36.8 13.64,36.8 13.53,36.91 12.44,38 12.44,38.2 12.44,46.15 15.9,49.61 16.66,50.37 36.93,50.37 42.41,44.88 42.41,40.28 43.86,38.84 50.19,38.84 50.39,38.84 54.43,34.8 54.61,34.62 54.61,32 54.61,31.83 54.33,31.55 U2.11
N$27
  Bottom 0.305: U$10.P$17 15.17,37.3 14.31,37.3 13.28,38.33 13.28,44.78 13.28,45.06 14.3,46.08 19.63,46.08 21.81,48.26 22.2,48.64 37.44,48.64 37.82,48.26 38.06,48.02 40.89,45.19 40.89,24.66 41.8,23.75 43.18,22.38 46.5,22.38 46.76,22.38 47.09,22.38 49.32,20.14 49.32,18.67 49.32,13.56 51.56,11.33 U3.4
N$28
  Bottom 0.305: U3.3 U3.2 54.35,8.79 54.56,8.58 54.76,8.38 54.76,6.86 54.56,6.65 54.3,6.4 53.84,6.4 51.69,6.4 48.54,9.55 47.9,10.19 47.9,18.74 45.97,20.68 45.49,20.68 45.16,20.68 42.62,20.68 39.04,24.26 39.04,43.61 35.86,46.79 23.01,46.79 18.39,42.16 18.39,40.87 18.94,40.31 U$10.P$5
N$29  (via drill 0.8 pad 1.93)
  Top 0.305: U$2.P$2 45.82,4.75 44.95,3.89 34.36,3.89 29.1,9.14 v28.7,9.55
  Bottom 0.305: U$10.P$26 26.92,35.31 27.1,35.31 27.12,35.31 27.3,35.31 27.5,35.1 27.5,34.92 27.5,25.5 25.07,23.06 25.07,14.12 28.5,10.69 28.5,9.75 v28.7,9.55
N$30  (via drill 0.8 pad 1.93)
  Top 0.305: U$2.P$1 46.32,3.75 | 46.32,3.75 46.32,3.7 | 46.32,3.75 46.32,3.52 45.87,3.07 32.89,3.07 27.1,8.86 27.1,11.94 27.1,14.53 v27.2,14.63
  Bottom 0.305: U$10.P$24 25.47,35.81 25.62,35.81 27.25,35.81 27.45,35.81 27.58,35.81 27.81,35.81 28.5,35.13 28.5,25.48 28.44,25.43 28.44,23.85 27.2,22.61 v27.2,14.63
N$31  (via drill 0.8 pad 1.93)
  Top 0.305: U$2.P$3 45.32,6.46 45.32,5.9 44.17,4.75 35,4.75 32.86,6.88 32.86,8.46 31.34,9.98 31.34,11.58 v29.89,13.03
  Bottom 0.305: U$10.P$22 | U$10.P$22 25.6,36.3 28.04,36.3 28.32,36.3 28.37,36.3 29.54,35.13 29.61,35.05 29.61,35 29.61,34.72 29.61,24.41 29.61,13.31 v29.89,13.03
N$32
  Top 0.305: U$2.P$8 42.82,11.38 42.41,11.79 41.42,11.79 41.2,12.01 41.2,12.94 U$6.1
N$33
  Top 0.305: U$2.P$4 44.82,11.44 45.03,11.66 47.52,11.66 48.18,12.32 48.18,12.96 U$25.1
N$34  (via drill 0.8 pad 1.93)
  Top 0.305: U$16.4 11.69,9.46 11.78,9.55 11.83,9.55 12.01,9.37 11.78,9.37 | 11.78,9.37 11.72,9.37 U$16.4 | 11.88,9.47 11.78,9.37 | U$16.4 11.3,9.79 v11.3,11.73 13.22,11.73 U$26.1
  Bottom 0.305: v11.3,11.73 10.82,12.22 9.29,12.22 6.47,15.04 6.47,34.49 3.63,37.34 3.63,47.65 5.46,49.48 8.78,49.48 10.72,47.55 10.72,37.62 12.53,35.8 U$10.P$23
N$35  (via drill 0.8 pad 1.93)
  Top 0.305: v13.84,25.25 13.84,23.75 13.7,23.61 | U$15.4 13.66,23.57 13.7,23.61 | U$27.1 14.98,22.33 13.7,23.61
  Bottom 0.305: U$10.P$31 15.51,33.8 15.03,33.32 13.84,32.13 v13.84,25.25
N$36  (via drill 0.8 pad 1.93)
  Top 0.305: v11.27,33.02 11.27,30.99 U$14.4 14.59,30.63 U$28.1
  Bottom 0.305: U$10.P$27 16.69,34.8 13.05,34.8 v11.27,33.02
N$37  (via drill 0.8 pad 1.93)
  Top 0.305: U$29.1 14.02,16.56 11.67,16.56 U$13.4 11.43,16.73 v11.43,18.8
  Bottom 0.305: U$10.P$29 18.47,34.3 14.54,34.3 14.51,34.3 12.92,32.71 12.92,29.01 11.63,27.71 11.63,19.18 11.43,18.97 v11.43,18.8
N$39  (via drill 0.8 pad 1.93)
  Top 0.305: v57.32,13.41 57.43,13.51 57.43,15.9 53.82,19.51 51.02,19.51 44.14,26.39 43.68,26.39 40.84,26.39 37.28,29.95 37.28,42.54 33.93,45.9 24.23,45.9 22.32,43.99 17.45,43.99 16.53,43.99 v16.15,43.61
  Bottom 0.305: U$5.3 58.4,15.07 58.4,14.67 58.4,14.64 57.29,13.53 57.29,13.45 v57.32,13.41 | v16.15,43.61 15.67,43.61 15.13,43.08 15.13,39.7 16,38.84 16.03,38.8 U$10.P$11
N$40  (via drill 0.8 pad 1.93)
  Top 0.305: v59.76,30.02 59.31,30.48 41.6,30.48 40.03,32.05 40.03,41.91 35.23,46.71 22.98,46.71 22.02,45.75 15.54,45.75 14.47,44.68 14.47,42.09 15.44,41.12 v16.76,41.12
  Bottom 0.305: v59.76,30.02 60.91,31.17 60.91,31.78 60.91,32.56 60.92,32.57 U$4.3 | U$10.P$9 18.58,39.3 v16.76,41.12
N$41  (via drill 0.8 pad 1.93)
  Top 0.305: v7.44,46.79 12.57,46.79 16.58,50.8 21.81,50.8 22.68,49.94 22.68,48.84 23.92,47.6 36.45,47.6 42.11,41.94 47.9,36.14 v50.64,36.14
  Bottom 0.305: U$10.P$25 9.25,35.3 7.41,37.13 7.41,46.76 v7.44,46.79 | v50.64,36.14 50.64,33.71 51.56,32.79 52.87,32.79 U2.10
OUT1  (1 unrouted)
  Top 1.016: U$32.2 20.35,4.63 | IC1.2 17.24,4.55 | 17.24,4.55 IC1.4 | U$36.1 18.63,9.41 17.19,7.98 17.19,4.6 17.24,4.55
R1IN
  Bottom 0.305: U2.13 54.78,29.01 54.94,29.01 57.76,29.01 58.14,28.63 58.29,28.47 62.38,28.47 63.6,29.69 SCANNER.P$3
V+  (via drill 0.8 pad 1.93)
  Top 0.305: U$2.P$7 U$2.P$6 | U$2.P$6 U$2.P$5 44.32,6.73 44.04,6.45 v43.56,6.45 43.48,6.45 42.52,5.49 35.51,5.49 34.15,6.84 U$17.1 U$7.1 33.22,13.13 30.6,15.75 30.04,16.31 26.13,16.31 24.33,14.5 23.95,14.12 22.07,14.12 21.38,14.81 21.38,16.76 21.38,25.91 19.57,27.72 U$8.14 17.98,28.52 17.78,28.73 17.78,34.57 17.61,34.73 | U$24.1 43.75,10.41 U$2.P$6 | U$1.P$2 6.99,37.85 8.86,37.85 12.47,37.85 12.92,37.85 12.98,37.79 14.02,36.75 14.12,36.75 15.59,36.75 15.72,36.63 15.87,36.47 17.61,34.73 | 17.61,34.73 17.67,34.67 | U$34.2 70.77,34.7
  Top 1.016: v28.62,3.38 28.62,4.09 27.14,5.57 U$31.2 25.2,6.48 23.67,6.48 23.29,6.86 21.92,6.86 IC1.3 | U$35.2 U$34.2 | 70.77,34.7 U$33.2 70.77,41.16 72.03,42.42 U$9.P$1
  Bottom 0.305: 55.28,14.95 54.99,15.24 54.89,15.24 55.14,14.99 55.14,13.69 55.14,13.31 56.64,11.81 56.64,7.85 56.69,7.8 56.79,7.7 56.97,7.52 U3.8 | 56.46,19.58 56.69,19.35 | U$5.4 56.7,15.38 56.82,15.27 | 59.22,32.37 59.33,32.26 59.65,32.57 U$4.4 | 43.4,3.15 43.33,3.23 43.56,3.45 v43.56,6.45 | 73.96,26.85 74.32,26.85 73.96,26.85
  Bottom 0.5: 57.15,32.84 57.02,32.84 56.94,32.92
  Bottom 0.813: U$9.P$1 72.03,42.42
  Bottom 1: 57,15.27 56.82,15.27 56.21,15.27 55.6,15.27 54.86,15.27 | 56.94,32.92 56.94,35.56 59.74,38.35 60.45,38.35 68.47,38.35 69.11,38.35 74.32,33.15 74.32,26.85 74.32,20.8 72.36,18.85 61.11,18.85 60.6,19.35 56.69,19.35 55.9,19.35 54.63,18.08 54.63,15.49 54.86,15.27 | 57.15,32.84 57.73,32.26 59.33,32.26 59.51,32.26 | 54.86,15.27 54.89,15.24
  Bottom 1.016: 74.32,26.85 78.56,26.85 80.57,24.84 80.57,4.42 79.3,3.15 44.93,3.15 43.4,3.15 31.34,3.15 28.88,3.15 28.85,3.15 v28.62,3.38
  Bottom 2: 72.03,42.42 71.93,42.42 62.73,42.42 62.51,42.42 60.7,40.61 60.7,38.61 60.45,38.35

### Text on the board
Milling: CHECON.PCB.v1.0P4